# EAGLE design flight comp v1 (EAGLE 9.4.2)
CNAME: FLIGHT COMPUTER; CREVISION: V1; DESIGNER: MICHAEL KIMANI
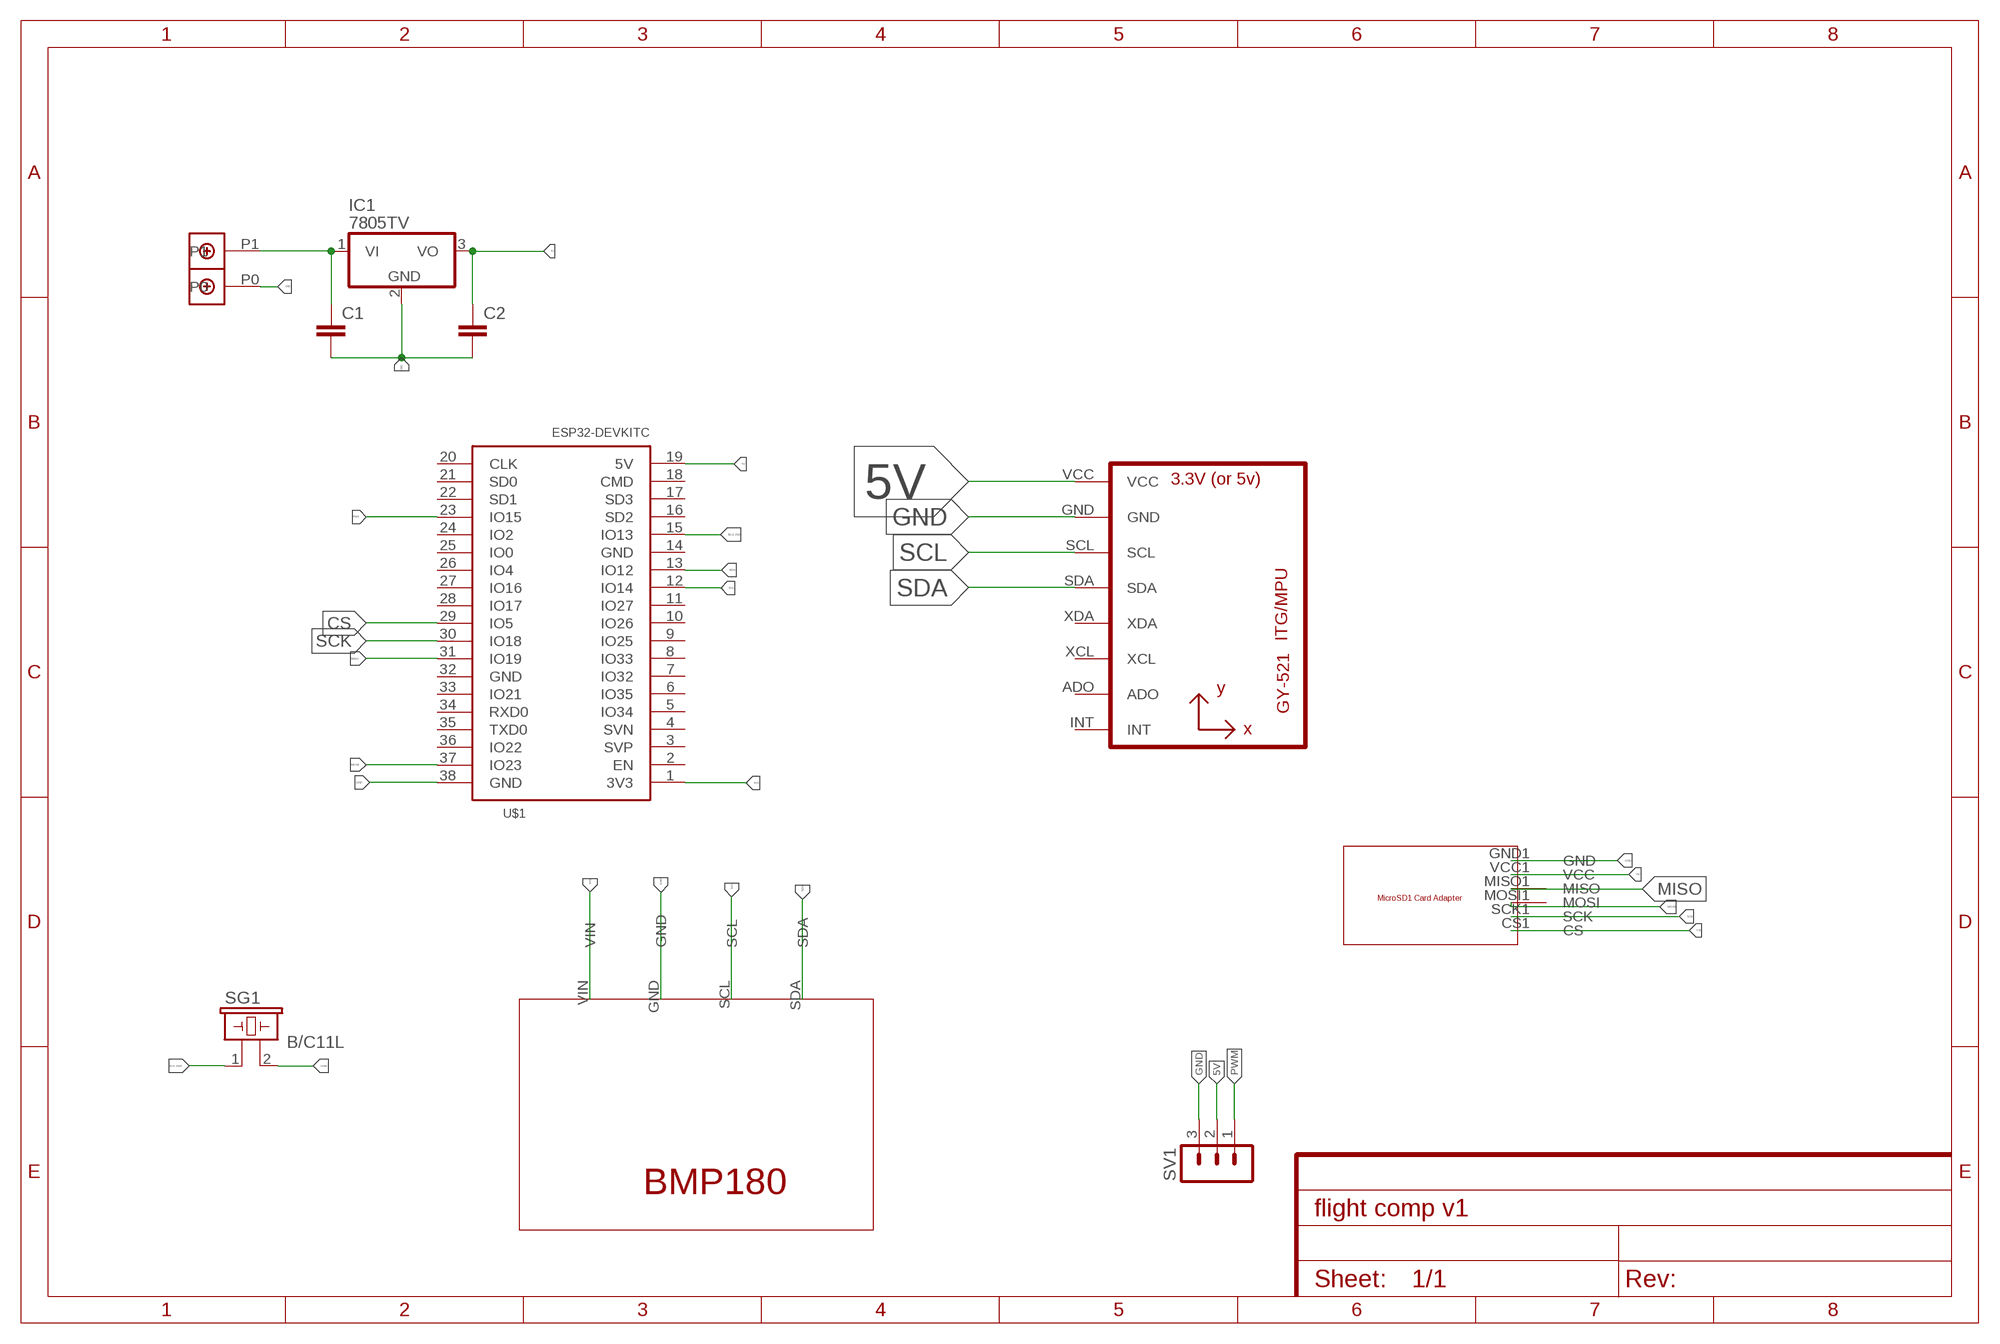
[diagram p0: schematic, sheet 1]

## Parts
C1  C2,5-3  [C2.5-3]
C2  C2,5-3  [C2.5-3]
IC1  7805TV  [TO220V]
SG1  B/C11L  [B/C11L]
SV1  MA03-1  [MA03-1]
U1  GY-521MPU6050  [GY-521]
U$1  ESP32DEVKITC  [ESP32-DEVKITC]
U$2  MICROSDADAPTER  [MICROSDADAPTER]
U$3  BMP180  [BMP180]
U$4  DBCONN-1X2  [DBCONN-1X2]

## Nets
3V3: U$1.1(3V3) U$3.VIN
5V: C2.1 IC1.3(VO) SV1.2 U1.VCC U$1.19(5V) U$2.VCC1(VCC)
BUZZER: SG1.1 U$1.15(IO13)
CS: U$1.29(IO5) U$2.CS1(CS)
GND: C1.2 C2.2 IC1.2(GND) SG1.2 SV1.3 U1.GND U$1.38(GND) U$2.GND1(GND) U$3.GND U$4.P0
MISO: U$1.31(IO19) U$2.MISO1(MISO)
MOSI: U$1.37(IO23) U$2.MOSI1(MOSI)
N$1: C1.1 IC1.1(VI) U$4.P1
PWM: SV1.1 U$1.23(IO15)
SCK: U$1.30(IO18) U$2.SCK1(SCK)
SCL: U1.SCL U$1.12(IO14) U$3.SCL
SDA: U1.SDA U$1.13(IO12) U$3.SDA
Unconnected: U1.ADO U1.INT U1.XCL U1.XDA U$1.2(EN) U$1.3(SVP) U$1.4(SVN) U$1.5(IO34) U$1.6(IO35) U$1.7(IO32) U$1.8(IO33) U$1.9(IO25) U$1.10(IO26) U$1.11(IO27) U$1.14(GND) U$1.16(SD2) U$1.17(SD3) U$1.18(CMD) U$1.20(CLK) U$1.21(SD0) U$1.22(SD1) U$1.24(IO2) U$1.25(IO0) U$1.26(IO4) U$1.27(IO16) U$1.28(IO17) U$1.32(GND) U$1.33(IO21) U$1.34(RXD0) U$1.35(TXD0) U$1.36(IO22)

## Library data of the parts
C1 C2 = capacitor-wima:C: CAPACITOR naming: grid - package width
IC1 = linear:78*: Positive VOLTAGE REGULATOR Source: http://cache.national.com/ds/LM/LM78L05.pdf http://www.fairchildsemi.com/ds/LM/LM7805.pdf
SG1 = buzzer:B/C11L: BUZZER Source: Buerklin; OC_FARNELL: unknown; OC_NEWARK: unknown
SV1 = con-lstb:MA03-1: PIN HEADER; OC_FARNELL: unknown; OC_NEWARK: unknown
U1 = gy-521:GY-521
U$1 = ESP32-DEVKITC:ESP32DEVKITC
U$2 = MicroSD Card Adapter:MICROSDADAPTER
U$3 = bmp1802:BMP180
U$4 = Terminal Block Connector:DBCONN-1X2

## Board
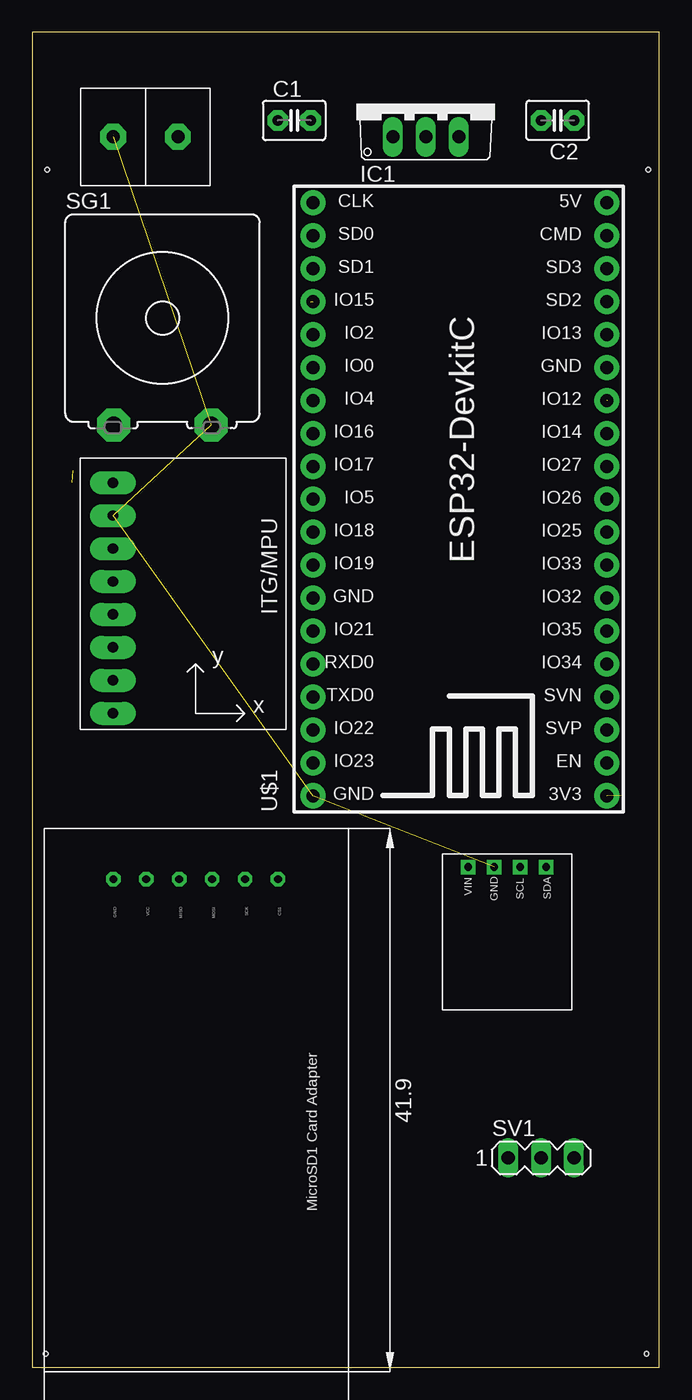
[diagram p1: board, top side]
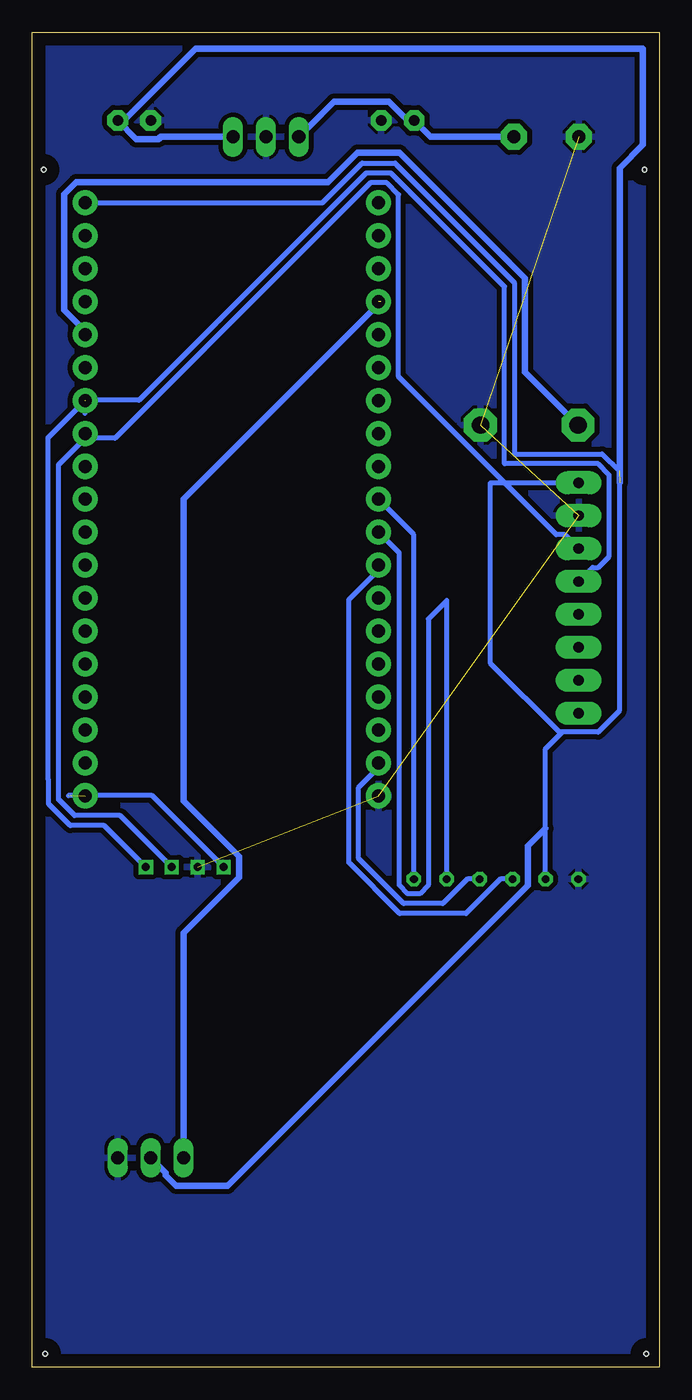
[diagram p2: board, bottom side, seen from below]

Size 48.37 x 102.92 mm. Coordinates in mm from the lower left corner, seen from the top.
Outline: 0,0 48.37,0 48.37,102.92 0,102.92 0,0
Copper layers (1*16): Top 0.035mm / dielectric 1.5mm / Bottom 0.035mm
Design rules "default *": minimum track width 20mil, minimum drill 0.35mm, track to track 15mil, track to pad 15mil, pad to pad 15mil, via to via 15mil, smd to smd 6mil, copper to edge 40mil, drill to drill 6mil, minimum pad ring 10mil, minimum via ring 8mil, stop-mask expansion 4mil, vias tented up to drill 0mil, thermal gap 10mil
Holes 0.35 mm at 1.02,1.02 47.37,1.02 47.5,92.33 1.14,92.33

### Footprints (pad centres in the part's own frame; a part is rotated, then mirrored left to right if it is on the bottom)
C2.5-3 = drill 0.813 pad 1.6 octagon: 1 -1.27,0; 2 1.27,0
TO220V = drill 1.016 long: 1 -2.54,-2.54; 2 0,-2.54; 3 2.54,-2.54
B/C11L = drill 1.321 pad 2.54 octagon: 1 -3.759,-8.255; 2 3.759,-8.255
MA03-1 = drill 1.016 long: 1 -2.54,0; 2 0,0; 3 2.54,0
GY-521 = drill 0.8 pad 1.778 long: ADO -8.89,-6.35; GND -8.89,6.35; INT -8.89,-8.89; SCL -8.89,3.81; SDA -8.89,1.27; VCC -8.89,8.89; XCL -8.89,-3.81; XDA -8.89,-1.27
ESP32-DEVKITC = drill 1 pad 1.93: 1 -22.87,-11.42; 2 -20.33,-11.42; 3 -17.79,-11.42; 4 -15.25,-11.42; 5 -12.71,-11.42; 6 -10.17,-11.42; 7 -7.63,-11.42; 8 -5.09,-11.42; 9 -2.55,-11.42; 10 -0.01,-11.42; 11 2.53,-11.42; 12 5.07,-11.42; 13 7.61,-11.42; 14 10.15,-11.42; 15 12.69,-11.42; 16 15.23,-11.42; 17 17.77,-11.42; 18 20.31,-11.42; 19 22.85,-11.42; 20 22.85,11.23; 21 20.31,11.23; 22 17.77,11.23; 23 15.23,11.23; 24 12.69,11.23; 25 10.15,11.23; 26 7.61,11.23; 27 5.07,11.23; 28 2.53,11.23; 29 -0.01,11.23; 30 -2.55,11.23; 31 -5.09,11.23; 32 -7.63,11.23; 33 -10.17,11.23; 34 -12.71,11.23; 35 -15.25,11.23; 36 -17.79,11.23; 37 -20.33,11.23; 38 -22.87,11.23
MICROSDADAPTER = drill 0.6 octagon: CS1 3.9,17.8; GND1 3.9,5.1; MISO1 3.9,10.18; MOSI1 3.9,12.72; SCK1 3.9,15.26; VCC1 3.9,7.64
BMP180 = drill 0.6 square: GND 4,11; SCL 6,11; SDA 8,11; VIN 2,11
DBCONN-1X2 = drill 1 pad 2 octagon: P0 -2.54,0; P1 2.46,0

### Placement (x,y rotation side)
C1  20.19,96.14 0 top
C2  40.51,96.14 180 top
IC1  30.35,97.41 0 top
SG1  10.03,80.9 0 top
SV1  39.24,16.13 0 top
U1  15.11,59.31 0 top
U$1  32.89,66.93 90 top
U$2  1.14,41.53 270 top
U$3  31.62,27.56 0 top
U$4  8.76,94.87 0 top

### Tracks (layer width: path | path; a pad name or v marks a point on that pad's centre or on a via)
3V3  (1 unrouted)
  Bottom 0.381: U$3.VIN 39.13,44.07 45.59,44.07
5V  (1 unrouted)
  Bottom 0.381: 7.49,48.96 4.73,48.96 3.11,50.58 3.11,69.12 4.41,70.42 11.19,70.42 11.19,83.63 20.39,92.84 22.93,92.84 25.99,89.78 U$1.19 | 7.49,48.96 7.72,48.96 13.03,54.27 13.03,68.2 U1.VCC | U$2.VCC1 8.78,41.53 8.78,47.67 7.49,48.96
  Bottom 0.508: 43.94,89.98 U$1.19 | IC1.3 38.48,94.87 38.65,94.7 40.35,94.7 C2.1 41.27,96.14 35.76,101.65 1.27,101.65 1.27,94.25 3.05,92.47 3.05,68.2 | SV1.2 38.1,14.99 38.1,14.79 37.28,13.97 33.3,13.97 10.13,37.14 10.13,40.18 8.78,41.53
BUZZER
  Bottom 0.508: SG1.1 10.36,76.73 10.36,83.97 20.05,93.67 23.27,93.67 25.56,91.38 44.98,91.38 45.91,90.44 45.91,81.5 44.31,79.9 U$1.15
CS
  Bottom 0.381: U$2.CS1 18.94,64.2 U$1.29
GND  (4 unrouted)
  pour Bottom: -3.94,105.03 51.94,105.03 59.56,97.41 60.83,96.14 60.83,-6.73 59.56,-8 -10.29,-8 -10.29,98.68
MISO
  Bottom 0.381: U$1.31 21.66,61.47 23.96,59.17 23.96,38.9 20.04,34.98 14.92,34.98 12.27,37.63 U$2.MISO1
MOSI
  Bottom 0.381: U$1.37 21.66,46.23 23.2,44.7 23.2,39.22 19.73,35.74 16.7,35.74 14.81,37.63 U$2.MOSI1
N$1
  Bottom 0.508: U$4.P1 17.65,94.87 C1.1 19.43,96.14 20.87,97.57 25.11,97.57 IC1.1
PWM  (1 unrouted)
  Bottom 0.508: 21.46,82.17 36.7,66.93 36.7,43.65 32.43,39.38 32.43,37.74 36.7,33.47 SV1.1
SCK
  Bottom 0.381: U$2.SCK1 16.4,59.12 17.82,57.7 17.82,37.16 18.48,36.5 19.41,36.5 20.07,37.16 20.07,62.78 U$1.30
SCL
  Bottom 0.381: 44.31,71.63 U$1.12 | U$3.SCL 41.59,42.52 45.12,42.52 46.35,43.75 46.35,69.59 44.31,71.63 | U1.SCL 7.3,64.2 7.95,64.2 20.13,76.37 20.13,90.42 21.03,91.32 22.3,91.32 41.98,71.63 44.31,71.63
SDA  (1 unrouted)
  Bottom 0.381: U$3.SDA 42.82,41.76 45.44,41.76 47.12,43.44 47.12,45.3 47.16,45.34 47.16,71.69 U$1.13 | U1.SDA 5.14,61.66 4.73,61.66 3.87,62.51 3.87,68.8 4.73,69.66 11.95,69.66 11.95,83.32 20.71,92.08 22.62,92.08 40.14,74.55 U$1.13 44.32,73.54

### Text on the board
tNames: Nakuja Flight Computer
tSilk: V1 | Nakuja flight computer